# EAGLE design MainBoard (EAGLE 6.2)
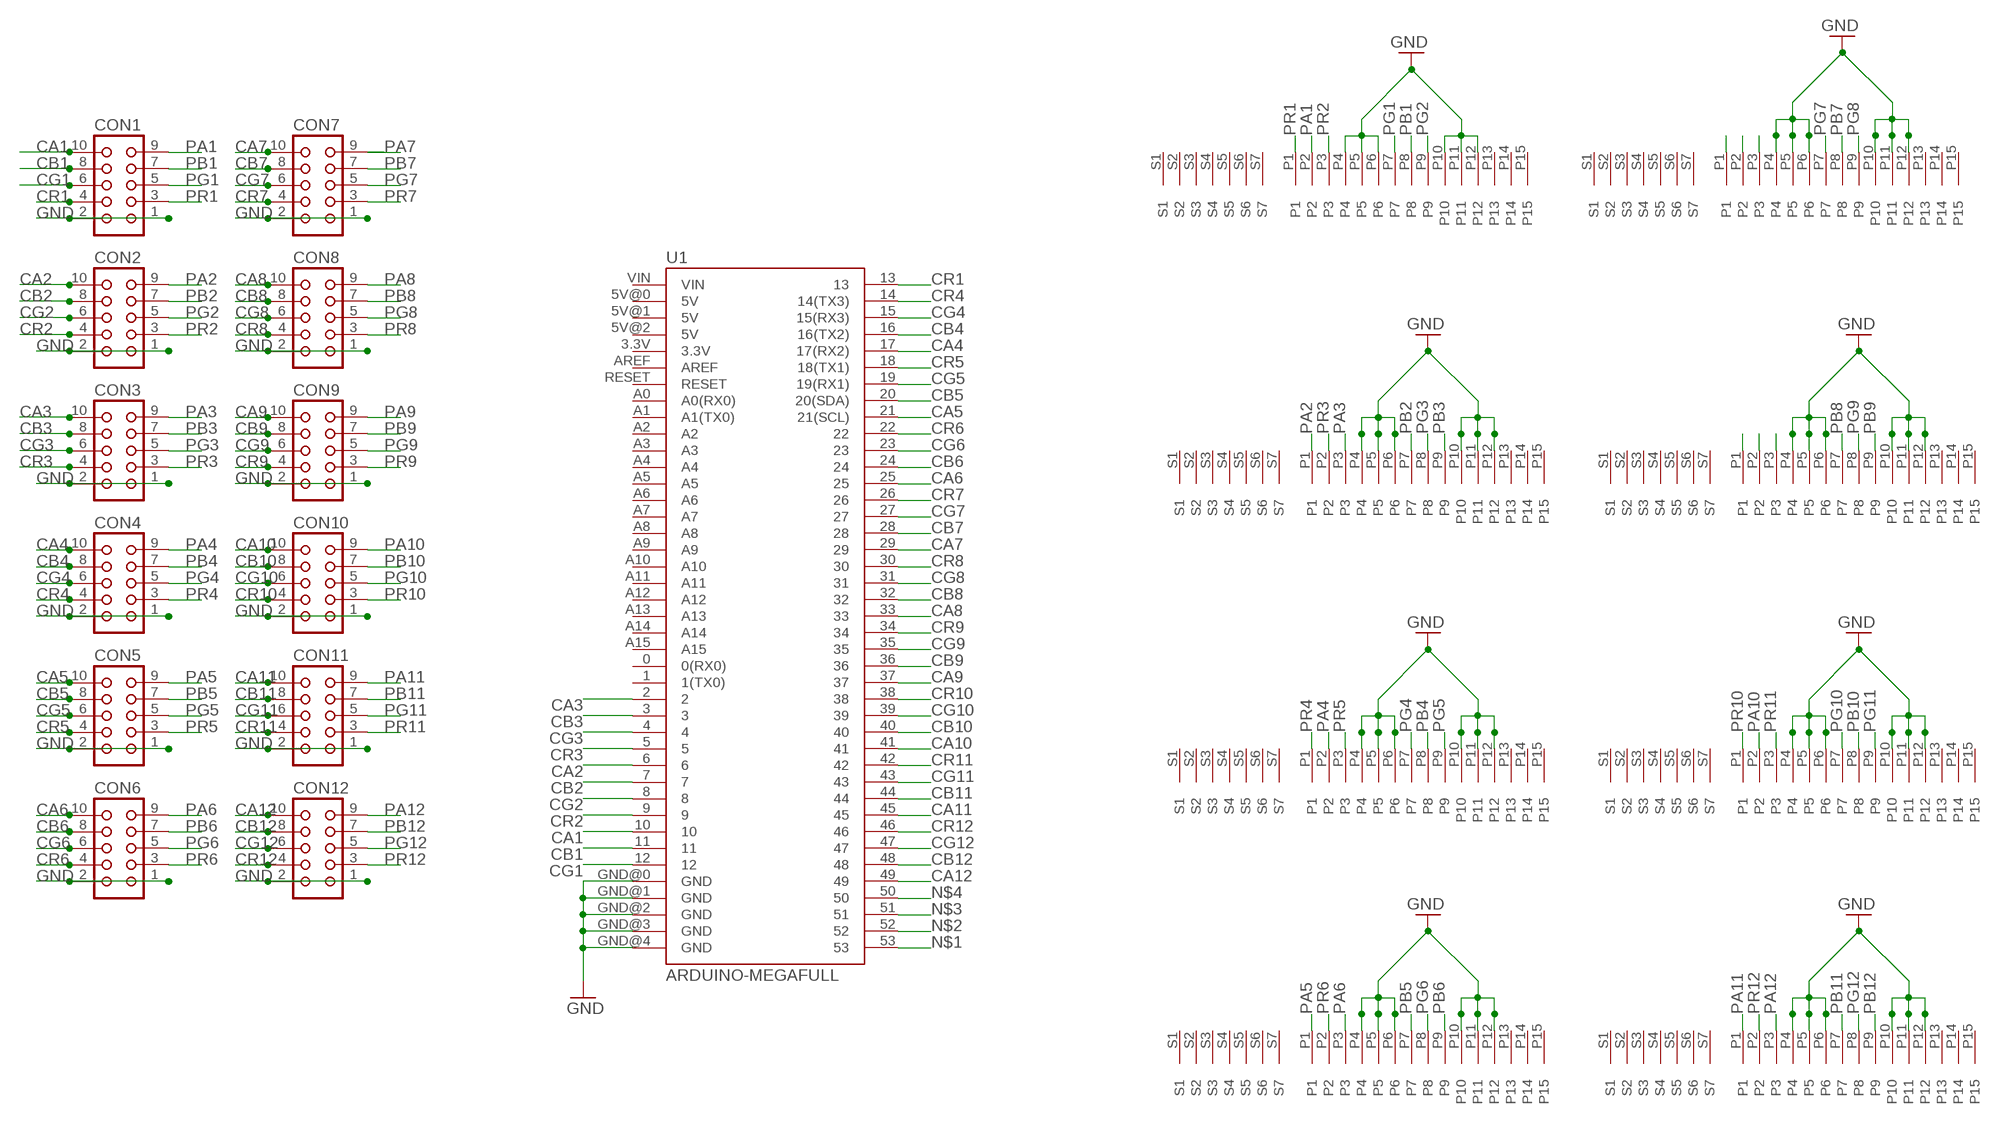
[diagram p0: schematic, sheet 1]

## Parts
CON1  CON10  [CON10]
CON2  CON10  [CON10]
CON3  CON10  [CON10]
CON4  CON10  [CON10]
CON5  CON10  [CON10]
CON6  CON10  [CON10]
CON7  CON10  [CON10]
CON8  CON10  [CON10]
CON9  CON10  [CON10]
CON10  CON10  [CON10]
CON11  CON10  [CON10]
CON12  CON10  [CON10]
P1  87779-1001  [87779-1001]
U1  ARDUINO-MEGAFULL  [ARDUINO_MEGA]
U$2  87779-1001  [87779-1001]
U$3  87779-1001  [87779-1001]
U$4  87779-1001  [87779-1001]
U$5  87779-1001  [87779-1001]
U$6  87779-1001  [87779-1001]
U$7  87779-1001  [87779-1001]
U$8  87779-1001  [87779-1001]

## Nets
CA1: CON1.10 U1.10
CA2: CON2.10 U1.6
CA3: CON3.10 U1.2
CA4: CON4.10 U1.17(17(RX2))
CA5: CON5.10 U1.21(21(SCL))
CA6: CON6.10 U1.25
CA7: CON7.10 U1.29
CA8: CON8.10 U1.33
CA9: CON9.10 U1.37
CA10: CON10.10 U1.41
CA11: CON11.10 U1.45
CA12: CON12.10 U1.49
CB1: CON1.8 U1.11
CB2: CON2.8 U1.7
CB3: CON3.8 U1.3
CB4: CON4.8 U1.16(16(TX2))
CB5: CON5.8 U1.20(20(SDA))
CB6: CON6.8 U1.24
CB7: CON7.8 U1.28
CB8: CON8.8 U1.32
CB9: CON9.8 U1.36
CB10: CON10.8 U1.40
CB11: CON11.8 U1.44
CB12: CON12.8 U1.48
CG1: CON1.6 U1.12
CG2: CON2.6 U1.8
CG3: CON3.6 U1.4
CG4: CON4.6 U1.15(15(RX3))
CG5: CON5.6 U1.19(19(RX1))
CG6: CON6.6 U1.23
CG7: CON7.6 U1.27
CG8: CON8.6 U1.31
CG9: CON9.6 U1.35
CG10: CON10.6 U1.39
CG11: CON11.6 U1.43
CG12: CON12.6 U1.47
CR1: CON1.4 U1.13
CR2: CON2.4 U1.9
CR3: CON3.4 U1.5
CR4: CON4.4 U1.14(14(TX3))
CR5: CON5.4 U1.18(18(TX1))
CR6: CON6.4 U1.22
CR7: CON7.4 U1.26
CR8: CON8.4 U1.30
CR9: CON9.4 U1.34
CR10: CON10.4 U1.38
CR11: CON11.4 U1.42
CR12: CON12.4 U1.46
GND: CON1.1 CON1.2 CON2.1 CON2.2 CON3.1 CON3.2 CON4.1 CON4.2 CON5.1 CON5.2 CON6.1 CON6.2 CON7.1 CON7.2 CON8.1 CON8.2 CON9.1 CON9.2 CON10.1 CON10.2 CON11.1 CON11.2 CON12.1 CON12.2 P1.P4 P1.P5 P1.P6 P1.P10 P1.P11 P1.P12 U1.GND@0(GND) U1.GND@1(GND) U1.GND@2(GND) U1.GND@3(GND) U1.GND@4(GND) U$2.P4 U$2.P5 U$2.P6 U$2.P10 U$2.P11 U$2.P12 U$3.P4 U$3.P5 U$3.P6 U$3.P10 U$3.P11 U$3.P12 U$4.P4 U$4.P5 U$4.P6 U$4.P10 U$4.P11 U$4.P12 U$5.P4 U$5.P5 U$5.P6 U$5.P10 U$5.P11 U$5.P12 U$6.P4 U$6.P5 U$6.P6 U$6.P10 U$6.P11 U$6.P12 U$7.P4 U$7.P5 U$7.P6 U$7.P10 U$7.P11 U$7.P12 U$8.P4 U$8.P5 U$8.P6 U$8.P10 U$8.P11 U$8.P12
N$1: U1.53
N$2: U1.52
N$3: U1.51
N$4: U1.50
PA1: CON1.9 P1.P2
PA2: CON2.9 U$2.P1
PA3: CON3.9 U$2.P3
PA4: CON4.9 U$3.P2
PA5: CON5.9 U$4.P1
PA6: CON6.9 U$4.P3
PA7: CON7.9 U$5.P2
PA8: CON8.9 U$6.P1
PA9: CON9.9 U$6.P3
PA10: CON10.9 U$7.P2
PA11: CON11.9 U$8.P1
PA12: CON12.9 U$8.P3
PB1: CON1.7 P1.P8
PB2: CON2.7 U$2.P7
PB3: CON3.7 U$2.P9
PB4: CON4.7 U$3.P8
PB5: CON5.7 U$4.P7
PB6: CON6.7 U$4.P9
PB7: CON7.7 U$5.P8
PB8: CON8.7 U$6.P7
PB9: CON9.7 U$6.P9
PB10: CON10.7 U$7.P8
PB11: CON11.7 U$8.P7
PB12: CON12.7 U$8.P9
PG1: CON1.5 P1.P7
PG2: CON2.5 P1.P9
PG3: CON3.5 U$2.P8
PG4: CON4.5 U$3.P7
PG5: CON5.5 U$3.P9
PG6: CON6.5 U$4.P8
PG7: CON7.5 U$5.P7
PG8: CON8.5 U$5.P9
PG9: CON9.5 U$6.P8
PG10: CON10.5 U$7.P7
PG11: CON11.5 U$7.P9
PG12: CON12.5 U$8.P8
PR1: CON1.3 P1.P1
PR2: CON2.3 P1.P3
PR3: CON3.3 U$2.P2
PR4: CON4.3 U$3.P1
PR5: CON5.3 U$3.P3
PR6: CON6.3 U$4.P2
PR7: CON7.3 U$5.P1
PR8: CON8.3 U$5.P3
PR9: CON9.3 U$6.P2
PR10: CON10.3 U$7.P1
PR11: CON11.3 U$7.P3
PR12: CON12.3 U$8.P2
Unconnected: P1.P13 P1.P14 P1.P15 P1.S1 P1.S2 P1.S3 P1.S4 P1.S5 P1.S6 P1.S7 U1.0(0(RX0)) U1.1(1(TX0)) U1.3.3V U1.5V@0(5V) U1.5V@1(5V) U1.5V@2(5V) U1.A0(A0(RX0)) U1.A1(A1(TX0)) U1.A2 U1.A3 U1.A4 U1.A5 U1.A6 U1.A7 U1.A8 U1.A9 U1.A10 U1.A11 U1.A12 U1.A13 U1.A14 U1.A15 U1.AREF U1.RESET U1.VIN U$2.P13 U$2.P14 U$2.P15 U$2.S1 U$2.S2 U$2.S3 U$2.S4 U$2.S5 U$2.S6 U$2.S7 U$3.P13 U$3.P14 U$3.P15 U$3.S1 U$3.S2 U$3.S3 U$3.S4 U$3.S5 U$3.S6 U$3.S7 U$4.P13 U$4.P14 U$4.P15 U$4.S1 U$4.S2 U$4.S3 U$4.S4 U$4.S5 U$4.S6 U$4.S7 U$5.P13 U$5.P14 U$5.P15 U$5.S1 U$5.S2 U$5.S3 U$5.S4 U$5.S5 U$5.S6 U$5.S7 U$6.P13 U$6.P14 U$6.P15 U$6.S1 U$6.S2 U$6.S3 U$6.S4 U$6.S5 U$6.S6 U$6.S7 U$7.P13 U$7.P14 U$7.P15 U$7.S1 U$7.S2 U$7.S3 U$7.S4 U$7.S5 U$7.S6 U$7.S7 U$8.P13 U$8.P14 U$8.P15 U$8.S1 U$8.S2 U$8.S3 U$8.S4 U$8.S5 U$8.S6 U$8.S7

## Library data of the parts
CON1-CON12 = con-harting:CON10: CONNECTOR; OC_FARNELL: unknown; OC_NEWARK: unknown
P1 U$2-U$8 = con-molex:87779-1001
U1 = SparkFun-Boards:ARDUINO-MEGA: Arduino Mega board footprint

## Board
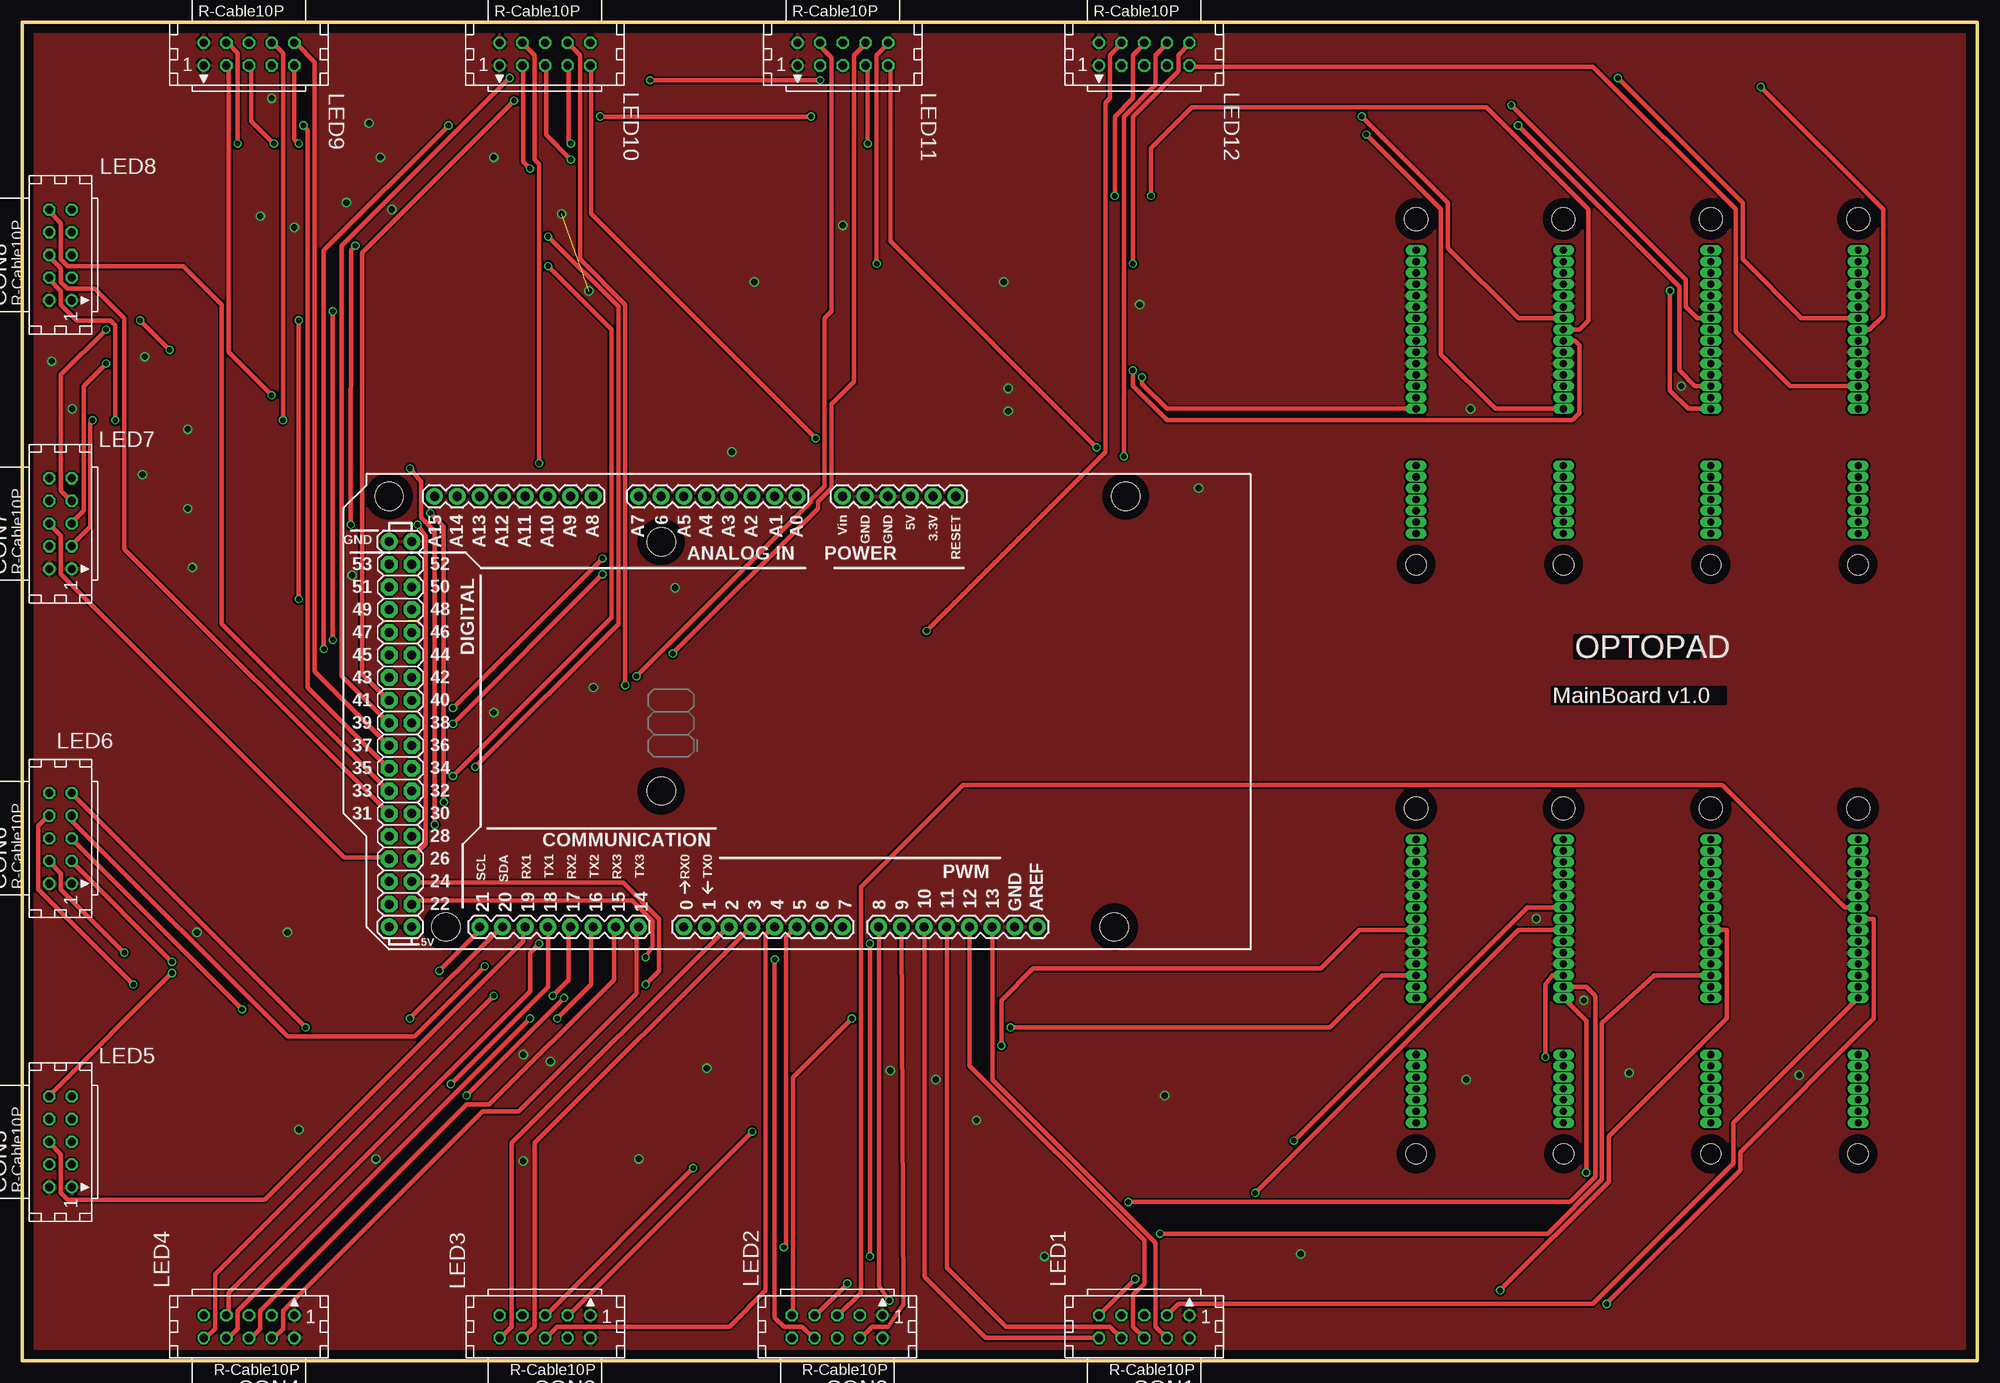
[diagram p1: board, top side]
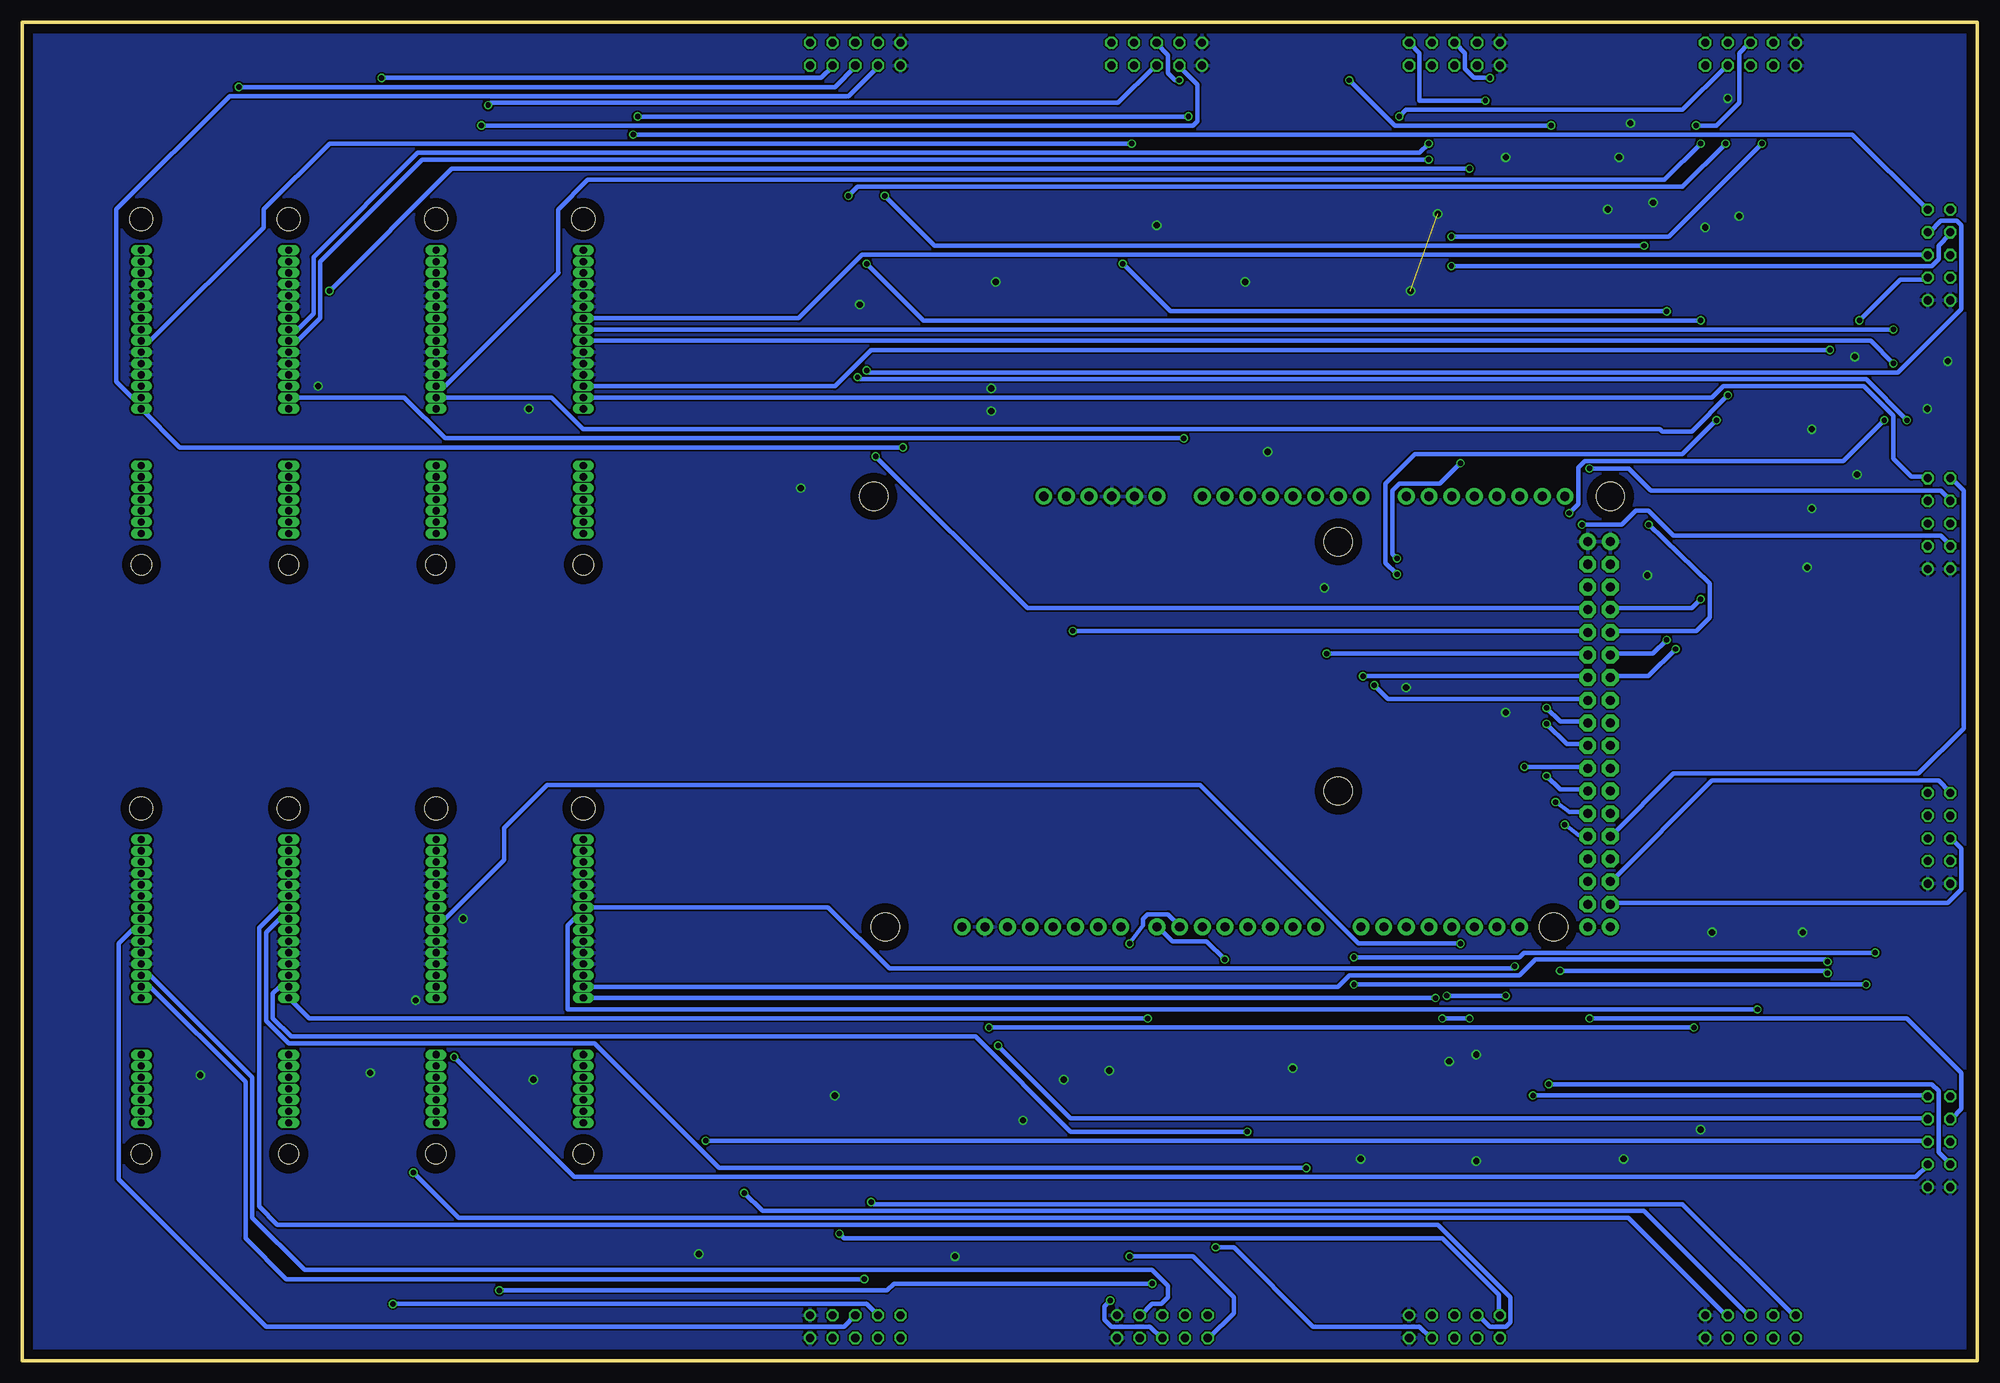
[diagram p2: board, bottom side, seen from below]

Size 219.08 x 150 mm. Coordinates in mm from the lower left corner, seen from the top.
Outline: 0,0 219.08,0 219.08,150 0,150 0,0
Copper layers (1*16): Top 0.035mm / dielectric 1.5mm / Bottom 0.035mm
Design rules: minimum track width 15mil, minimum drill 24mil, track to track 8mil, track to pad 4mil, pad to pad 2mil, via to via 2mil, smd to smd 8mil, copper to edge 40mil, drill to drill 8mil, minimum pad ring 2mil, minimum via ring 2mil, stop-mask expansion 4mil, vias tented up to drill 0mil, thermal gap 10mil

### Footprints (pad centres in the part's own frame; a part is rotated, then mirrored left to right if it is on the bottom)
CON10 = drill 0.914: 1 -5.08,-1.27 | drill 0.914 octagon: 2 -5.08,1.27; 3 -2.54,-1.27; 4 -2.54,1.27; 5 0,-1.27; 6 0,1.27; 7 2.54,-1.27; 8 2.54,1.27; 9 5.08,-1.27; 10 5.08,1.27
87779-1001 = drill 0.8 pad 1.016 long: P1 0,13.97; P2 0,15.24; P3 0,16.51; P4 0,17.78; P5 0,19.05; P6 0,20.32; P7 0,21.59; P8 0,22.86; P9 0,24.13; P10 0,25.4; P11 0,26.67; P12 0,27.94; P13 0,29.21; P14 0,30.48; P15 0,31.75; S1 0,0; S2 0,1.27; S3 0,2.54; S4 0,3.81; S5 0,5.08; S6 0,6.35; S7 0,7.62 | hole 2.3: 0,-3.49 | hole 2.6: 0,35.24
ARDUINO_MEGA = drill 1.016 pad 1.88: 0 63.5,50.8; 1 60.96,50.8; 2 58.42,50.8; 3 55.88,50.8; 3.3V 35.56,2.54; 4 53.34,50.8; 5 50.8,50.8; 5V@0 38.1,2.54; 5V@1 93.98,50.8; 5V@2 96.52,50.8; 6 48.26,50.8; 7 45.72,50.8; 8 41.656,50.8; 9 39.116,50.8; 10 36.576,50.8; 11 34.036,50.8; 12 31.496,50.8; 13 28.956,50.8; 14 68.58,50.8; 15 71.12,50.8; 16 73.66,50.8; 17 76.2,50.8; 18 78.74,50.8; 19 81.28,50.8; 20 83.82,50.8; 21 86.36,50.8; A0 50.8,2.54; A1 53.34,2.54; A2 55.88,2.54; A3 58.42,2.54; A4 60.96,2.54; A5 63.5,2.54; A6 66.04,2.54; A7 68.58,2.54; A8 73.66,2.54; A9 76.2,2.54; A10 78.74,2.54; A11 81.28,2.54; A12 83.82,2.54; A13 86.36,2.54; A14 88.9,2.54; A15 91.44,2.54; AREF 23.876,50.8; GND@0 40.64,2.54; GND@1 43.18,2.54; GND@2 93.98,7.62; GND@3 96.52,7.62; GND@4 26.416,50.8; RESET 33.02,2.54; VIN 45.72,2.54 | drill 1.016 pad 1.88 octagon: 22 93.98,48.26; 23 96.52,48.26; 24 93.98,45.72; 25 96.52,45.72; 26 93.98,43.18; 27 96.52,43.18; 28 93.98,40.64; 29 96.52,40.64; 30 93.98,38.1; 31 96.52,38.1; 32 93.98,35.56; 33 96.52,35.56; 34 93.98,33.02; 35 96.52,33.02; 36 93.98,30.48; 37 96.52,30.48; 38 93.98,27.94; 39 96.52,27.94; 40 93.98,25.4; 41 96.52,25.4; 42 93.98,22.86; 43 96.52,22.86; 44 93.98,20.32; 45 96.52,20.32; 46 93.98,17.78; 47 96.52,17.78; 48 93.98,15.24; 49 96.52,15.24; 50 93.98,12.7; 51 96.52,12.7; 52 93.98,10.16; 53 96.52,10.16 | hole 3.2: 15.24,50.8; 13.97,2.54; 66.04,35.56; 66.04,7.62; 90.17,50.8; 96.52,2.54

### Placement (x,y rotation side)
CON1  125.73,3.81 180 top
CON2  91.32,3.81 180 top
CON3  58.58,3.81 180 top
CON4  25.41,3.81 180 top
CON5  4.28,24.53 90 top
CON6  4.28,58.54 90 top
CON7  4.28,93.82 90 top
CON8  4.28,123.92 90 top
CON9  25.41,146.43 0 top
CON10  58.58,146.43 0 top
CON11  91.95,146.43 0 top
CON12  125.73,146.43 0 top
P1  205.74,26.67 0 top
U1  137.63,99.41 180 top
U$2  189.23,26.67 0 top
U$3  172.72,26.67 0 top
U$4  156.21,26.67 0 top
U$5  156.21,92.71 0 top
U$6  172.72,92.71 0 top
U$7  189.23,92.71 0 top
U$8  205.74,92.71 0 top

### Tracks (layer width: path | path; a pad name or v marks a point on that pad's centre or on a via)
CA1
  Top 0.508: U1.10 101.09,48.51 101.09,9.4 107.95,2.54 CON1.10
CA2  (via drill 0.61)
  Top 0.508: v95,46.74 v95,11.68
  Bottom 0.508: v95,46.74 93.47,48.77 93.47,49.53 92.96,50.04 90.68,50.04 89.41,48.77 U1.6 | CON2.10 86.11,2.54 83.31,5.33 83.31,7.11 87.88,11.68 v95,11.68
CA3
  Top 0.508: CON3.10 53.59,2.54 54.86,3.81 54.86,24.38 78.99,48.51 U1.2
CA4  (via drill 0.61)
  Top 0.508: v52.83,40.89 21.59,9.65 21.59,3.56 20.57,2.54 CON4.10 | v59.44,40.89 61.21,42.67 61.21,48.51 U1.17
  Bottom 0.508: v59.44,40.89 v52.83,40.89
CA5  (via drill 0.61)
  Top 0.508: v16.76,43.43 3.05,29.72 CON5.10 | v46.74,43.69 51.05,48.01 51.05,48.51 U1.21
  Bottom 0.508: v16.76,43.43 17.02,43.69 v46.74,43.69
CA6
  Bottom 0.508: CON6.10 3.05,63.75 4.32,65.02 29.72,65.02 40.89,53.85 U1.25
CA7
  Bottom 0.508: CON7.10 2.79,98.81 1.52,97.54 1.52,70.87 6.6,65.79 34.04,65.79 40.89,58.93 U1.29
CA8
  Top 0.508: CON8.10 3.05,128.78 4.32,127.51 4.32,123.44 5.08,122.68 18.03,122.68 22.35,118.36 22.35,82.55 22.61,82.3 40.89,64.01 U1.33
CA9
  Top 0.508: CON9.10 30.73,147.57 32.77,145.54 32.77,77.22 40.89,69.09 U1.37
CA10  (via drill 0.61)
  Top 0.508: v55.12,141.22 38.1,124.21 38.1,76.96 40.89,74.17 U1.41
  Bottom 0.508: v55.12,141.22 62.48,141.22 62.48,146.56 63.5,147.57 CON10.10
CA11  (via drill 0.61)
  Top 0.508: v95.76,122.94 95.76,146.3 97.03,147.57 CON11.10 | v34.8,80.77 v34.8,117.6
  Bottom 0.508: v95.76,122.94 90.42,117.6 v34.8,117.6 | v34.8,80.77 36.32,79.25 40.89,79.25 U1.45
CA12  (via drill 0.61)
  Top 0.508: v124.46,122.94 124.46,139.45 129.54,144.53 129.54,146.3 130.81,147.57 CON12.10 | v30.99,85.34 v30.99,116.59
  Bottom 0.508: v124.46,122.94 118.11,116.59 v30.99,116.59 | v30.99,85.34 32,84.33 40.89,84.33 U1.49
CB1
  Top 0.508: CON1.8 121.92,3.81 110.24,3.81 103.63,10.41 103.63,48.57 U1.11 103.63,48.51
CB2  (via drill 0.61)
  Top 0.508: CON2.8 88.65,2.54 87.38,3.81 85.34,3.81 84.33,4.83 v84.33,44.96
  Bottom 0.508: v84.33,44.96 86.36,46.99 90.17,46.99 91.69,48.51 U1.7
CB3
  Top 0.508: CON3.8 56.13,2.54 57.4,3.81 57.4,24.38 81.53,48.51 U1.3
CB4  (via drill 0.61)
  Top 0.508: v56.9,38.35 24.13,5.59 24.13,3.56 23.11,2.54 CON4.8 | v59.94,38.35 63.75,42.16 63.75,48.51 U1.16
  Bottom 0.508: v59.94,38.35 v56.9,38.35
CB5  (via drill 0.61)
  Top 0.508: v43.43,38.35 53.59,48.51 U1.20
  Bottom 0.508: CON5.8 2.79,27.18 1.78,28.19 1.78,32.26 7.87,38.35 v43.43,38.35
CB6  (via drill 0.61)
  Top 0.508: v12.45,42.16 1.78,52.83 1.78,59.94 2.79,60.96 CON6.8 | v69.85,42.16 71.37,43.69 71.37,49.53 67.31,53.59 43.69,53.59 U1.24
  Bottom 0.508: v69.85,42.16 v12.45,42.16
CB7  (via drill 0.61)
  Top 0.508: v43.46,100 44.7,98.55 44.7,94.49 46.23,92.96 v46.23,60.07
  Bottom 0.508: v46.23,60.07 44.7,58.93 43.69,58.93 U1.28 | CON7.8 3.05,96.52 4.06,97.54 36.55,97.54 39.01,100 v43.46,100
CB8  (via drill 0.61)
  Top 0.508: v58.93,122.68 66.04,115.57 66.04,83.31 v48.26,65.53
  Bottom 0.508: v48.26,65.53 46.74,64.01 43.69,64.01 U1.32 | CON8.8 3.05,126.24 4.32,124.97 4.32,123.44 5.08,122.68 v58.93,122.68
CB9  (via drill 0.61)
  Top 0.508: v29.21,105.41 29.21,146.56 28.19,147.57 CON9.8 | v48.26,71.37 v65.02,88.14
  Bottom 0.508: v29.21,105.41 33.02,101.6 62.99,101.6 66.29,98.3 66.29,89.41 v65.02,88.14 | v48.26,71.37 45.97,69.09 43.69,69.09 U1.36
CB10  (via drill 0.61)
  Top 0.508: v67.56,75.69 67.56,118.36 62.48,123.44 62.48,146.3 61.21,147.57 CON10.8
  Bottom 0.508: v67.56,75.69 66.04,74.17 43.69,74.17 U1.40
CB11  (via drill 0.61)
  Top 0.508: v72.9,79.25 89.15,95.5 89.15,96.27 90.68,97.79 90.68,107.19 93.22,109.73 93.22,146.3 94.49,147.57 CON11.8
  Bottom 0.508: v72.9,79.25 43.69,79.25 U1.44
CB12  (via drill 0.61)
  Top 0.508: v123.44,101.35 123.44,139.45 127,143 127,146.3 128.27,147.57 CON12.8
  Bottom 0.508: v123.44,101.35 106.43,84.33 43.69,84.33 U1.48
CG1
  Top 0.508: CON1.6 124.46,3.81 124.46,7.37 125.73,8.64 125.73,13.46 106.17,33.02 106.17,48.51 U1.12
CG2  (via drill 0.61)
  Top 0.508: v97.16,6.73 96.01,8.38 96.01,48.51 U1.8
  Bottom 0.508: CON2.6 91.44,2.54 92.71,3.81 97.03,3.81 97.79,4.57 97.79,6.1 v97.16,6.73
CG3
  Top 0.508: CON3.6 58.67,2.54 59.94,3.81 79.25,3.81 83.31,7.87 83.31,47.75 84.07,48.51 U1.4
CG4
  Top 0.508: CON4.6 25.65,2.54 26.67,3.56 26.67,5.59 49.78,28.7 52.32,28.7 66.29,42.67 66.29,48.51 U1.15
CG5
  Top 0.508: CON5.6 3.05,24.38 4.32,23.11 4.32,18.8 5.08,18.03 27.18,18.03 56.13,46.99 56.13,48.51 U1.19
CG6
  Bottom 0.508: CON6.6 2.79,58.42 1.78,57.4 1.78,52.83 3.3,51.31 40.95,51.31 U1.23 40.89,51.31
CG7
  Top 0.508: CON7.6 3.05,93.73 4.32,92.46 4.32,88.14 36.07,56.39 40.89,56.39 U1.27
CG8
  Top 0.508: CON8.6 3.05,123.7 4.32,122.43 4.32,120.9 5.08,120.14 8.13,120.14 11.43,116.84 11.43,90.99 U1.31 40.89,61.21
CG9  (via drill 0.61)
  Top 0.508: v31.5,138.43 32,137.92 32,75.44 40.89,66.55 U1.35
  Bottom 0.508: CON9.6 25.65,147.57 26.67,146.56 26.67,140.97 29.21,138.43 v31.5,138.43
CG10  (via drill 0.61)
  Top 0.508: v54.61,143.76 35.81,124.97 35.81,76.71 40.89,71.63 U1.39
  Bottom 0.508: CON10.6 58.42,147.57 57.4,146.56 57.4,144.78 56.39,143.76 v54.61,143.76
CG11  (via drill 0.61)
  Top 0.508: v70.36,143.51 v89.41,143.51 | v47.75,138.43 33.78,124.46 v33.78,79.76
  Bottom 0.508: v70.36,143.51 65.28,138.43 v47.75,138.43 | v33.78,79.76 36.83,76.71 40.89,76.71 U1.43 | CON11.6 91.95,147.57 90.68,146.3 90.68,144.27 89.92,143.51 v89.41,143.51
CG12  (via drill 0.61)
  Top 0.508: v122.43,130.56 122.43,139.45 124.46,141.48 124.46,146.3 125.73,147.57 CON12.6 | v37.34,124.97 36.83,124.46 v36.8,93.7
  Bottom 0.508: v122.43,130.56 116.84,124.97 v37.34,124.97 | U1.47 40.89,81.79 31.5,81.79 29.97,83.31 29.97,87.12 v36.8,93.7
CR1
  Top 0.508: CON1.4 127,3.81 127,13.21 108.71,31.5 108.71,48.51 U1.13
CR2
  Top 0.508: CON2.4 93.98,2.54 95.25,3.81 97.03,3.81 98.78,6.3 98.55,48.57 U1.9 98.55,48.51
CR3  (via drill 0.61)
  Top 0.508: v85.34,12.7 85.6,12.95 85.6,47.5 86.61,48.51 U1.5
  Bottom 0.508: v85.34,12.7 83.31,12.7 74.42,3.81 62.48,3.81 61.21,2.54 CON3.4
CR4
  Top 0.508: CON4.4 28.19,2.54 29.21,3.56 29.21,5.59 51.56,27.94 55.63,27.94 68.83,41.15 68.83,48.51 U1.14
CR5  (via drill 0.61)
  Top 0.508: v48.01,30.99 58.93,41.91 58.93,48.51 U1.18
  Bottom 0.508: CON5.4 3.05,22.1 4.32,23.37 4.32,30.23 5.08,30.99 v48.01,30.99
CR6  (via drill 0.61)
  Top 0.508: v11.43,45.72 4.32,52.83 4.32,54.61 3.05,55.88 CON6.4 | v69.85,45.21 70.61,46.48 70.61,49.28 68.33,51.56 43.69,51.56 43.69,51.31 U1.22
  Bottom 0.508: v69.85,45.21 51.31,45.21 50.8,45.72 v11.43,45.72
CR7  (via drill 0.61)
  Top 0.508: v44.3,93.7 45.21,92.46 45.21,57.91 43.69,56.39 U1.26
  Bottom 0.508: CON7.4 3.05,91.44 4.06,92.46 34.04,92.46 36.83,95.25 38.28,95.25 39.8,93.73 40.64,93.73 v44.3,93.7
CR8  (via drill 0.61)
  Top 0.508: v45.72,95 47.24,93.47 v47.24,62.61 | CON8.4 3.05,121.16 4.32,119.89 4.32,118.36 6.1,116.59 9.91,116.59 10.41,116.08 v10.41,105.41
  Bottom 0.508: v10.41,105.41 14.99,100.84 43.94,100.84 44.7,100.08 44.7,96.01 v45.72,95 | v47.24,62.61 45.72,61.47 43.69,61.47 U1.30
CR9  (via drill 0.61)
  Top 0.508: v24.13,136.4 24.13,146.56 23.11,147.57 CON9.4 | v58.93,125.98 66.8,118.11 66.8,82.55 v50.75,66.55
  Bottom 0.508: v24.13,136.4 34.54,125.98 v58.93,125.98 | v50.75,66.55 43.69,66.55 U1.34
CR10  (via drill 0.61)
  Top 0.508: v57.91,100.58 57.91,134.11 57.4,134.62 57.4,146.3 56.13,147.57 CON10.4 | v48.26,73.15 v65.02,89.92
  Bottom 0.508: v57.91,100.58 60.2,98.3 64.77,98.3 65.53,97.54 65.53,90.42 v65.02,89.92 | v48.26,73.15 46.74,71.63 43.69,71.63 U1.38
CR11  (via drill 0.61)
  Top 0.508: 89.41,147.57 CON11.4 89.41,147.32 90.68,146.05 90.68,117.6 89.92,116.84 89.92,98.04 88.39,96.52 88.39,96.27 v68.83,76.71
  Bottom 0.508: v68.83,76.71 43.69,76.71 U1.42
CR12  (via drill 0.61)
  Top 0.508: v101.35,81.79 121.41,101.85 121.41,140.97 121.92,141.48 121.92,146.3 123.19,147.57 CON12.4
  Bottom 0.508: v101.35,81.79 43.69,81.79 U1.46
GND  (via drill 0.7)  (1 unrouted)
  other vias: 36.96,88.01 131.83,97.79 26.67,128.27 30.48,127 38.86,138.68 40.13,134.87 52.83,134.87 36.32,129.79 60.45,128.52 19.05,88.9 109.98,120.9 73.15,86.61 110.49,106.43 52.83,72.64 69.09,22.61 76.71,32.77 114.55,11.68 106.93,26.92 143.26,11.94 180.09,32.26 128.02,29.72 161.8,31.5 125.22,118.36 18.54,104.39 3.3,112.01 18.54,95.5 13.46,99.31 13.72,112.52 29.72,48.01 82.04,120.9 79.5,101.85 169.67,49.53 199.14,32 175.01,40.39 102.36,31.5 97.28,32.51 56.13,22.35 59.18,33.53 56.13,34.29 39.62,22.61 30.99,25.91 19.56,48.01 5.59,106.68 63.5,119.89 41.4,129.03 27.94,141.48 91.95,127.25 110.49,108.97 162.31,106.68 185.93,109.22 64.01,75.44
  pour Top: 0,150 219.08,150 219.08,0 0,0
  pour Bottom: 0,150 219.08,150 219.08,0 0,0
PA1  (via drill 0.61)
  Top 0.508: CON1.9 v124.71,9.14
  Bottom 0.508: P1.P2 204.72,41.91 194.06,31.24 194.06,13.72 189.48,9.14 v124.71,9.14
PA2  (via drill 0.61)
  Top 0.508: v92.96,38.35 86.36,31.75 86.36,5.08 CON2.9
  Bottom 0.508: U$2.P1 186.94,38.35 v92.96,38.35
PA3  (via drill 0.61)
  Top 0.508: v127.51,14.22 170.94,14.22 177.04,20.32 177.04,37.85 182.88,43.18 U$2.P3
  Bottom 0.508: v127.51,14.22 127,13.72 59.94,13.72 53.59,7.37 53.59,5.08 CON3.9
PA4  (via drill 0.61)
  Top 0.508: v123.95,17.78 173.48,17.78 176.28,20.57 176.28,40.89 175.26,41.91 U$3.P2
  Bottom 0.508: v123.95,17.78 123.7,17.53 33.02,17.53 20.57,5.08 CON4.9
PA5  (via drill 0.61)
  Top 0.508: v49.78,29.72 v60.71,40.64
  Bottom 0.508: v60.71,40.64 U$4.P1 | v49.78,29.72 5.59,29.72 CON5.9
PA6  (via drill 0.61)
  Top 0.508: v31.75,37.34 5.59,63.5 CON6.9 | v110.74,37.34 146.56,37.34 152.4,43.18 U$4.P3
  Bottom 0.508: v31.75,37.34 v110.74,37.34
PA7
  Bottom 0.508: U$5.P2 29.72,107.95 28.45,109.22 12.7,109.22 9.4,105.92 9.4,101.09 7.37,99.06 5.59,99.06 CON7.9
PA8  (via drill 0.61)
  Top 0.508: v150.62,137.41 159,129.03 159,112.78 165.1,106.68 U$6.P1
  Bottom 0.508: v150.62,137.41 13.97,137.41 5.59,129.03 CON8.9
PA9  (via drill 0.61)
  Top 0.508: v30.99,136.4 30.48,136.91 30.48,145.03 CON9.9
  Bottom 0.508: U$6.P3 171.7,109.22 159,121.92 159.03,121.94 159.03,129.01 155.7,132.33 35.05,132.33 v30.99,136.4
PA10  (via drill 0.61)
  Top 0.508: v88.9,103.38 63.75,128.52 63.75,145.03 CON10.9
  Bottom 0.508: U$7.P2 176.28,107.95 171.7,103.38 v88.9,103.38
PA11  (via drill 0.61)
  Top 0.508: v120.4,102.36 97.28,125.48 97.28,145.03 CON11.9
  Bottom 0.508: U$8.P1 201.42,102.36 v120.4,102.36
PA12
  Top 0.508: CON12.9 130.81,145.03 176.02,145.03 192.02,129.03 192.02,115.32 198.12,109.22 U$8.P3
PB1  (via drill 0.61)
  Top 0.508: P1.P8 207.52,49.53 207.52,38.35 192.53,23.37 192.53,21.34 v177.55,6.35
  Bottom 0.508: v177.55,6.35 124.46,6.35 CON1.7
PB2  (via drill 0.61)
  Top 0.508: U$2.P7 191.01,48.26 191.01,38.35 177.8,25.15 177.8,20.07 v165.61,7.87 | v92.46,8.64 88.9,5.08 CON2.7
  Bottom 0.508: v92.46,8.64 121.41,8.64 122.17,7.87 v165.61,7.87
PB3
  Bottom 0.508: U$2.P9 190.25,50.8 192.53,48.51 192.53,17.27 190.5,15.24 60.45,15.24 52.32,7.11 52.32,4.32 52.83,3.81 54.61,3.81 55.88,5.08 CON3.7
PB4  (via drill 0.61)
  Top 0.508: v57.91,46.74 56.9,45.72 56.9,41.4 23.11,7.62 23.11,5.08 CON4.7
  Bottom 0.508: U$3.P8 171.7,49.53 165.1,56.13 165.1,59.69 160.27,64.52 87.12,64.52 69.34,46.74 v57.91,46.74
PB5  (via drill 0.61)
  Top 0.508: v109.73,35.31 109.73,40.39 113.28,43.94 145.54,43.94 149.86,48.26 U$4.P7
  Bottom 0.508: v109.73,35.31 101.6,27.18 5.59,27.18 CON5.7
PB6  (via drill 0.61)
  Top 0.508: v51.82,44.2 43.94,36.32 29.72,36.32 5.59,60.45 5.59,60.96 CON6.7
  Bottom 0.508: U$4.P9 128.78,50.8 121.92,43.94 52.07,43.94 v51.82,44.2
PB7  (via drill 0.61)
  Top 0.508: v9.4,115.57 4.32,110.49 4.32,97.54 5.33,96.52 CON7.7
  Bottom 0.508: v9.4,115.57 U$5.P8
PB8  (via drill 0.61)
  Top 0.508: v124.46,111 124.46,109.22 128.27,105.41 173.74,105.41 174.5,106.17 174.5,113.79 173.99,114.3 U$6.P7
  Bottom 0.508: v124.46,111 124.21,110.74 8.89,110.74 1.78,117.86 1.78,127.25 2.29,127.76 4.06,127.76 5.33,126.49 CON8.7
PB9  (via drill 0.61)
  Top 0.508: v150.11,139.45 159.77,129.79 159.77,124.71 167.64,116.84 U$6.P9 | v64.77,139.45 v88.39,139.45
  Bottom 0.508: v88.39,139.45 v150.11,139.45 | v64.77,139.45 64.01,140.21 33.02,140.21 28.19,145.03 CON9.7
PB10  (via drill 0.61)
  Top 0.508: v61.47,136.4 61.21,136.65 61.21,145.03 CON10.7
  Bottom 0.508: U$7.P8 188.21,115.57 186.56,117.22 186.44,117.35 186.44,123.7 174.75,135.38 62.48,135.38 v61.47,136.4
PB11  (via drill 0.61)
  Top 0.508: v94.74,136.4 94.74,145.03 CON11.7
  Bottom 0.508: U$8.P7 204.72,114.3 192.02,127 192.02,129.03 184.66,136.4 v94.74,136.4
PB12  (via drill 0.61)
  Top 0.508: v178.82,143.76 192.79,129.79 192.79,123.44 199.39,116.84 U$8.P9
  Bottom 0.508: v178.82,143.76 129.54,143.76 128.27,145.03 CON12.7
PG1
  Bottom 0.508: P1.P7 206.76,48.26 208.28,46.74 208.28,20.32 191.77,3.81 127,3.81 CON1.5
PG2
  Top 0.508: CON2.5 91.44,5.08 93.98,7.62 93.98,53.09 105.41,64.52 190.5,64.52 204.22,50.8 P1.P9
PG3  (via drill 0.61)
  Top 0.508: v75.18,21.59 58.67,5.08 CON3.5
  Bottom 0.508: U$2.P8 190.25,49.53 191.77,48.01 191.77,38.1 189.23,35.56 154.94,35.56 140.97,21.59 v75.18,21.59
PG4  (via drill 0.61)
  Top 0.508: v138.18,18.8 167.64,48.26 U$3.P7
  Bottom 0.508: v138.18,18.8 136.14,16.76 37.34,16.76 25.65,5.08 CON4.5
PG5  (via drill 0.61)
  Top 0.508: v142.49,24.64 168.66,50.8 U$3.P9
  Bottom 0.508: v142.49,24.64 5.59,24.64 CON5.5
PG6  (via drill 0.61)
  Top 0.508: v24.64,39.37 5.59,58.42 CON6.5
  Bottom 0.508: U$4.P8 157.23,49.53 157.99,48.77 157.99,39.37 v24.64,39.37
PG7  (via drill 0.61)
  Top 0.508: v9.4,111.76 6.86,109.22 6.86,95.25 5.59,93.98 CON7.5
  Bottom 0.508: U$5.P7 11.94,114.3 v9.4,111.76
PG8
  Bottom 0.508: U$5.P9 132.08,116.84 124.97,123.95 5.59,123.95 CON8.5
PG9  (via drill 0.61)
  Top 0.508: v28.19,136.4 25.65,138.94 25.65,145.03 CON9.5 | v126.49,130.56 126.49,135.89 131.06,140.46 164.08,140.46 175.51,129.03 175.51,116.59 174.5,115.57 U$6.P8
  Bottom 0.508: v126.49,130.56 125.48,131.57 33.02,131.57 v28.19,136.4
PG10  (via drill 0.61)
  Top 0.508: v61.47,134.62 58.67,137.41 58.67,145.03 CON10.5
  Bottom 0.508: U$7.P7 188.21,114.3 185.8,116.71 185.67,116.84 185.67,123.19 174.24,134.62 v61.47,134.62
PG11  (via drill 0.61)
  Top 0.508: v166.88,140.72 186.44,121.16 186.44,118.11 187.71,116.84 U$7.P9
  Bottom 0.508: v166.88,140.72 166.62,140.97 96.27,140.97 92.2,145.03 CON11.5
PG12  (via drill 0.61)
  Top 0.508: v194.82,142.75 208.53,129.03 208.53,117.09 207.01,115.57 U$8.P8
  Bottom 0.508: v194.82,142.75 128.02,142.75 125.73,145.03 CON12.5
PR1
  Top 0.508: P1.P1 191.77,26.67 191.77,22.1 176.02,6.35 129.54,6.35 CON1.3
PR2
  Bottom 0.508: P1.P3 204.72,43.18 193.29,31.75 193.29,16 187.45,10.16 92.46,10.16 90.68,8.38 90.68,7.11 91.44,6.35 92.46,6.35 93.73,5.08 CON2.3
PR3  (via drill 0.61)
  Top 0.508: v81.79,25.65 61.21,5.08 CON3.3
  Bottom 0.508: U$2.P2 190.25,41.91 191.01,41.15 191.01,38.35 188.98,36.32 112.27,36.32 101.6,25.65 v81.79,25.65
PR4  (via drill 0.61)
  Top 0.508: U$3.P1 175.26,38.1 v175.26,21.08
  Bottom 0.508: v175.26,21.08 170.18,16 39.12,16 28.19,5.08 CON4.3
PR5  (via drill 0.61)
  Top 0.508: U$3.P3 171.45,43.18 170.69,42.16 v170.69,34.04
  Bottom 0.508: v170.69,34.04 157.23,20.57 6.86,20.57 5.59,21.84 CON5.3
PR6  (via drill 0.61)
  Top 0.508: v16.76,44.7 5.59,55.88 CON6.3
  Bottom 0.508: U$4.P2 71.63,41.91 70.36,43.18 51.31,43.18 49.53,44.96 17.02,44.96 v16.76,44.7
PR7  (via drill 0.61)
  Top 0.508: v7.87,105.41 7.62,105.16 7.62,93.47 5.59,91.44 CON7.3 | v125.48,110.24 125.48,109.47 128.27,106.68 U$5.P1
  Bottom 0.508: v125.48,110.24 125.22,109.98 12.45,109.98 v7.87,105.41
PR8  (via drill 0.61)
  Top 0.508: v13.21,116.59 v16.51,113.28
  Bottom 0.508: U$5.P3 128.02,109.22 123.95,113.28 v16.51,113.28 | v13.21,116.59 8.64,121.16 5.59,121.16 CON8.3
PR9  (via drill 0.61)
  Top 0.508: v27.94,108.2 23.11,113.03 23.11,145.03 CON9.3
  Bottom 0.508: U$6.P2 159.77,107.95 156.21,104.39 35.56,104.39 35.31,104.14 32,104.14 v27.94,108.2
PR10  (via drill 0.61)
  Top 0.508: v56.9,133.6 56.13,134.37 56.13,145.03 CON10.3 | U$7.P1 186.69,106.68 184.66,108.71 v184.66,119.89
  Bottom 0.508: v184.66,119.89 170.94,133.6 v56.9,133.6
PR11  (via drill 0.61)
  Top 0.508: v167.64,138.43 185.42,120.65 185.67,120.4 185.67,111 187.45,109.22 U$7.P3
  Bottom 0.508: v167.64,138.43 87.88,138.43 87.38,138.94 87.38,143 89.41,145.03 CON11.3
PR12
  Bottom 0.508: U$8.P2 206.76,107.95 208.53,109.73 208.53,129.03 195.83,141.73 126.49,141.73 123.19,145.03 CON12.3

### Text on the board
Top: OPTOPAD | MainBoard v1.0
tNames: LED9 | LED10 | LED11 | LED12 | LED8 | LED7 | OPTOPAD | MainBoard v1.0 | LED6 | LED5 | LED4 | LED3 | LED2 | LED1